# Altium project Smart Thermostat.PrjPcb
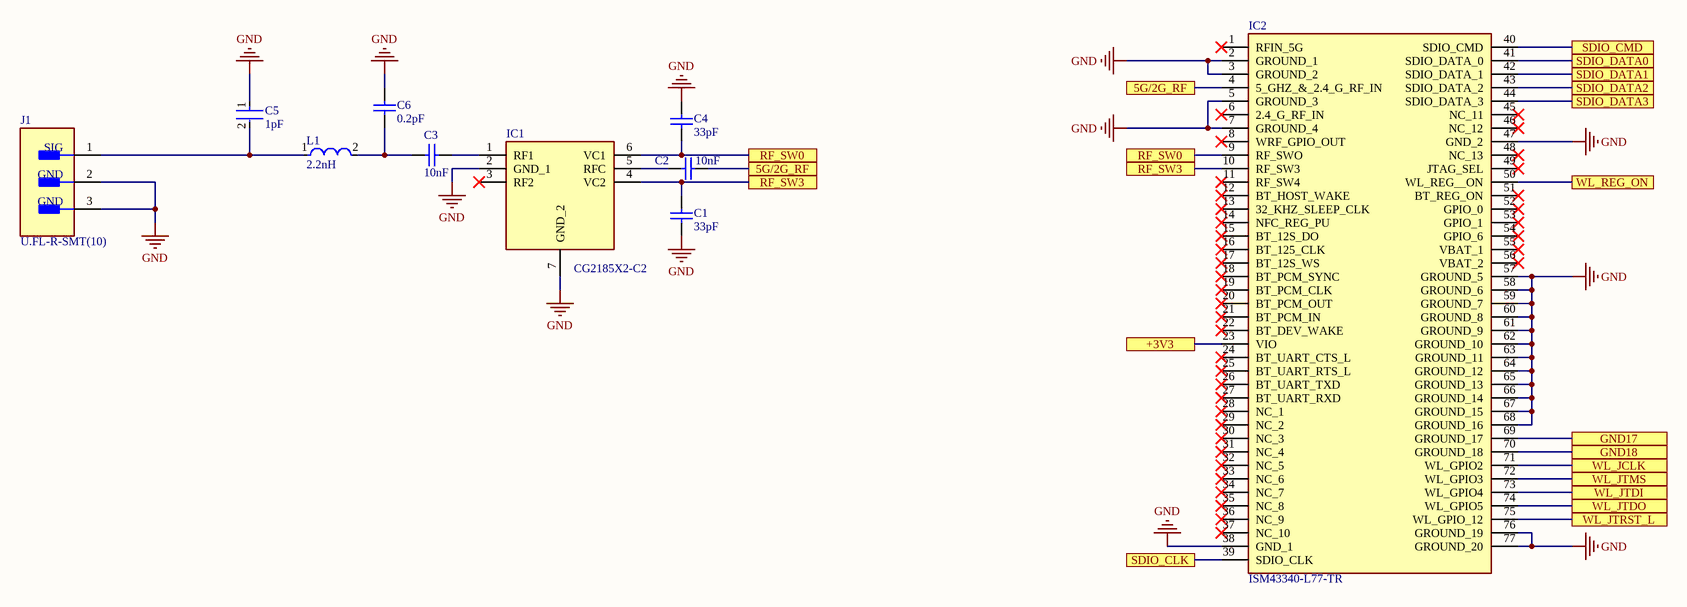
[diagram p0: Wi-Fi.schdoc]
6 sheets, 103 parts. Net scope: flat (ports and power ports of the same name join across sheets).
Board file: PCB1.PcbDoc
Sheets:
  Wi-Fi.schdoc
  LCD.SchDoc
  JTAG.SchDoc
  Relays.SchDoc
  Misc.SchDoc
  CPU.SchDoc

## Sheet Wi-Fi.schdoc
size Tabloid

### Parts
C1  33pF  [CAPC1005X56X25ML10T15]
C2  10nF  [CAPC1608X90X35ML10T15]
C3  10nF  [CAPC1608X90X35ML10T15]
C4  33pF  [CAPC1005X56X25ML10T15]
C5  1pF  [FP-GJM155-0_05-IPC_B]
C6  0.2pF  [CAPC1608X74X38NL10T13]
IC1  CG2185X2-C2  [SON35P100X100X37-7N]
IC2  ISM43340-L77-TR  [ISM43340L77TR]
J1  U.FL-R-SMT(10)  [FP-U_FL-R-SMT_10-MFG]
L1  2.2nH  [FP-LQW15AN_00-W0_6-0_1-MFG]

### Ports
5G/2G_RF, +3V3, GND17, GND18, RF_SW0, RF_SW3, SDIO_CLK, SDIO_CMD, SDIO_DATA0, SDIO_DATA1, SDIO_DATA2, SDIO_DATA3, WL_JCLK, WL_JTDI, WL_JTDO, WL_JTMS, WL_JTRST_L, WL_REG_ON

### Nets
GND: C1.1 C4.2 C5.1 C6.2 IC1.2(GND_1) IC1.7(GND_2) IC2.2(GROUND_1) IC2.3(GROUND_2) IC2.5(GROUND_3) IC2.7(GROUND_4) IC2.38(GND_1) IC2.47(GND_2) IC2.57(GROUND_5) IC2.58(GROUND_6) IC2.59(GROUND_7) IC2.60(GROUND_8) IC2.61(GROUND_9) IC2.62(GROUND_10) IC2.63(GROUND_11) IC2.64(GROUND_12) IC2.65(GROUND_13) IC2.66(GROUND_14) IC2.67(GROUND_15) IC2.68(GROUND_16) IC2.76(GROUND_19) IC2.77(GROUND_20) J1.2(GND) J1.3(GND)
NetC1_2: C1.2 IC1.4(VC2) IC2.10(RF_SW3) ; port RF_SW3
NetC2_1: C2.1 IC1.5(RFC)
NetC2_2: C2.2 IC2.4(5_GHZ_&_2.4_G_RF_IN) ; port 5G/2G_RF
NetC3_1: C3.1 C6.1 L1.2
NetC3_2: C3.2 IC1.1(RF1)
NetC4_1: C4.1 IC1.6(VC1) IC2.9(RF_SWO) ; port RF_SW0
NetC5_2: C5.2 J1.1(SIG) L1.1
NetC11_2: IC2.23(VIO) ; port +3V3
NetIC2_39: IC2.39(SDIO_CLK) ; port SDIO_CLK
NetIC2_40: IC2.40(SDIO_CMD) ; port SDIO_CMD
NetIC2_41: IC2.41(SDIO_DATA_0) ; port SDIO_DATA0
NetIC2_42: IC2.42(SDIO_DATA_1) ; port SDIO_DATA1
NetIC2_43: IC2.43(SDIO_DATA_2) ; port SDIO_DATA2
NetIC2_44: IC2.44(SDIO_DATA_3) ; port SDIO_DATA3
NetIC2_50: IC2.50(WL_REG__ON) ; port WL_REG_ON
NetIC2_69: IC2.69(GROUND_17) ; port GND17
NetIC2_70: IC2.70(GROUND_18) ; port GND18
NetIC2_71: IC2.71(WL_GPIO2) ; port WL_JCLK
NetIC2_72: IC2.72(WL_GPIO3) ; port WL_JTMS
NetIC2_73: IC2.73(WL_GPIO4) ; port WL_JTDI
NetIC2_74: IC2.74(WL_GPIO5) ; port WL_JTDO
NetIC2_75: IC2.75(WL_GPIO_12) ; port WL_JTRST_L

Not connected (* = marked no-connect by the designer): IC1 3(RF2)*; IC2 1(RFIN_5G)* 6(2.4_G_RF_IN)* 8(WRF_GPIO_OUT)* 11(RF_SW4)* 12(BT_HOST_WAKE)* 13(32_KHZ_SLEEP_CLK)* 14(NFC_REG_PU)* 15(BT_12S_DO)* 16(BT_125_CLK)* 17(BT_12S_WS)* 18(BT_PCM_SYNC)* 19(BT_PCM_CLK)* 20(BT_PCM_OUT)* 21(BT_PCM_IN)* 22(BT_DEV_WAKE)* 24(BT_UART_CTS_L)* 25(BT_UART_RTS_L)* 26(BT_UART_TXD)* 27(BT_UART_RXD)* 28(NC_1)* 29(NC_2)* 30(NC_3)* 31(NC_4)* 32(NC_5)* 33(NC_6)* 34(NC_7)* 35(NC_8)* 36(NC_9)* 37(NC_10)* 45(NC_11)* 46(NC_12)* 48(NC_13)* 49(JTAG_SEL)* 51(BT_REG_ON)* 52(GPIO_0)* 53(GPIO_1)* 54(GPIO_6)* 55(VBAT_1)* 56(VBAT_2)*

### Notes on the sheet
- Title
- Size:
- Date:
- Tabloid
- Number:
- Time:
- Revision:
- Sheet
- of
- File:

### Library data of the parts
C1 C4 = CMP-2008-02637-1: Manufacturer: AVX Interconnect / Elco; Part Number: 04025A330JAT2A
C2 C3 = CMP-2100-03642-1: Chip Capacitor, 10 nF, +/- 10%, 50 V, -55 to 125 degC, 0603 (1608 Metric), RoHS, Tape and Reel; Manufacturer: Murata; Insulation Resistance: 10GR; Dielectric: X7R; Voltage Rating: 50V; Material: Ceramic; Package Quantity: 1; Lead Free: LeadFree; Case/Package: 0603; Termination: SMD/SMT; REACH SVHC: Unknown; Manufacturer URL: http://www.murata.com/; Datasheet URL: http://search.murata.co.jp/Ceramy/image/img/A01X/G101/ENG/GRM188R71H103KA01-01.pdf; Mount: SurfaceMount; Datasheet Version: 42401.0; Number of Pins: 2; Length: 1.6mm; Voltage: 50V; Depth: 0.8mm; Tolerance: 10%; Min Operating Temperature: -55degC; Voltage Rating (DC): 50V; Max Operating Temperature: 125degC; Package Description: 2-Pin Surface Mount Device, Body 1.6 x 0.8 mm; RoHSCompliant: True; Case Code (Imperial): 0603; Width: 0.031inch; Case Code (Metric): 1608; Height: 0.8mm; Package Reference: 0603; Packaging: TapeandReel; Thickness: 0.035inch; Capacitance: 10nF; Dielectric Material: Ceramic
C5 = CMP-2008-03808-2: Multi-Layer Ceramic Capacitor 1pF C0G  ±0.1pF 0402 Paper T/R; Temperature Coefficient: 30ppm/°C; Voltage Rating (DC): 50V; REACH SVHC: No SVHC; Packaging: Tape and Reel; Width: 0.02inch; Package Quantity: 10000; Min Operating Temperature: -55°C; Case Code (Imperial): 0402; Lead Pitch: 0.3mm; Capacitance: 1pF; Length: 1mm; Max Operating Temperature: 125°C; Depth: 0.5mm; Thickness: 0.022inch; Case Code (Metric): 1005; Lead Free: Lead Free; Voltage: 50V; Mount: Surface Mount; Number of Pins: 2; Termination: SMD/SMT; Radiation Hardening: No; Dielectric: C0G; Case/Package: 0402; Voltage Rating: 50V; Height: 0.5mm
C6 = CMP-2006-03941-1: Manufacturer: AVX Interconnect / Elco; Part Number: ML03V10R2BAT2A
IC1 = CG2185X2-C2: Integrated Circuit; Manufacturer_Name: CEL; Datasheet Link: https://www.mouser.com/datasheet/2/286/CG2185X2-965115.pdf; Height: 0.37mm; Manufacturer_Part_Number: CG2185X2-C2
IC2 = ISM43340-L77-TR: Integrated Circuit; Manufacturer_Name: Inventek; Datasheet Link: https://www.mouser.com/datasheet/2/908/ISM4334X_Functional_Specification-1371237.pdf; Height: 2mm; Manufacturer_Part_Number: ISM43340-L77-TR; Mouser Part Number: 347-ISM43340L77TR; Mouser Price/Stock: https://www.mouser.com/Search/Refine.aspx?Keyword=347-ISM43340L77TR
J1 = CMP-0029-00003-2: CONN U.FL RCPT STR 50 OHM SMD; Plating: Silver; Connector Type: Coaxial; Frequency: 6GHz; Impedance: 50R; Body Material: Bronze; Dielectric Material: Polymer; Contact Plating: Gold; Termination: Solder; Orientation: Vertical; Contact Material: Brass; Min Operating Temperature: -40°C; Mount: Surface Mount; Lead Free: Lead Free; Max Operating Temperature: 90°C; Radiation Hardening: No; Packaging: Tape and Reel; Body Plating: Silver; Fastening Type: Snap; Max Frequency: 6GHz; Depth: 3.1mm; Package Quantity: 1; Case/Package: SMD/SMT; Housing Color: Beige; Length: 3mm
L1 = CMP-06042-008786-1: Wire Wound RF Inductor 2.2nH ±0.2nH 1000mA 0.027Ω 0402 (1005); Q Factor: 25; Current Rating: 1A; Core Material: Air; Test Frequency: 100MHz; Shielding: Unshielded; DC Resistance (DCR): 27mR; Self Resonant Frequency: 14GHz; Min Operating Temperature: -55°C; Package Quantity: 10000; Length: 1mm; Number of Pins: 2; Radiation Hardening: No; Case Code (Metric): 1005; Termination: SMD/SMT; Inductance: 2.2nH; Mount: Surface Mount; DC Current: 1A; Military Standard: Not; Max Operating Temperature: 125°C; Max DC Current: 1A; Lead Free: Lead Free; Depth: 0.7mm; Case/Package: 0402; Packaging: Tape and Reel; Height: 0.5mm; Width: 0.5mm; REACH SVHC: No SVHC; Weight: 2.8E-05oz; Case Code (Imperial): 0402

## Sheet LCD.SchDoc
size Tabloid
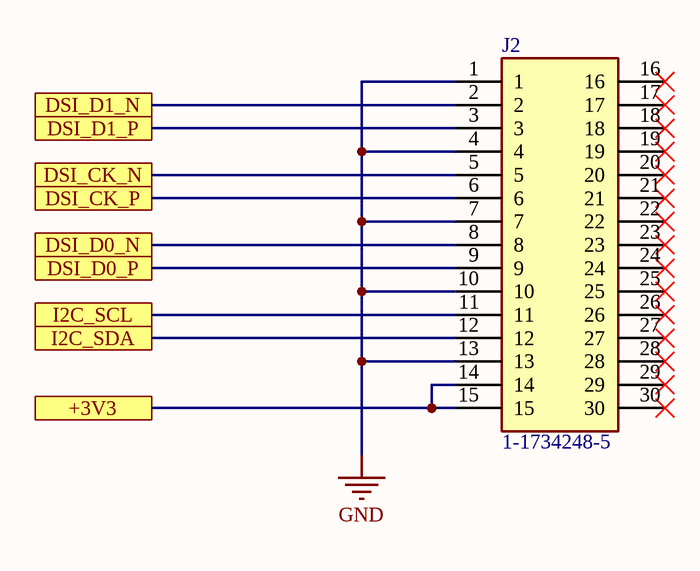
[diagram p1: LCD.SchDoc]

### Parts
J2  1-1734248-5  [117342485]

### Ports
+3V3, DSI_CK_N, DSI_CK_P, DSI_D0_N, DSI_D0_P, DSI_D1_N, DSI_D1_P, I2C_SCL, I2C_SDA

### Nets
GND: J2.1 J2.4 J2.7 J2.10 J2.13
NetC11_2: J2.14 J2.15 ; port +3V3
NetJ2_2: J2.2 ; port DSI_D1_N
NetJ2_3: J2.3 ; port DSI_D1_P
NetJ2_5: J2.5 ; port DSI_CK_N
NetJ2_6: J2.6 ; port DSI_CK_P
NetJ2_8: J2.8 ; port DSI_D0_N
NetJ2_9: J2.9 ; port DSI_D0_P
NetJ2_11: J2.11 ; port I2C_SCL
NetJ2_12: J2.12 ; port I2C_SDA

Not connected (* = marked no-connect by the designer): J2 16* 17* 18* 19* 20* 21* 22* 23* 24* 25* 26* 27* 28* 29* 30*

### Notes on the sheet
- Title
- Size:
- Date:
- Tabloid
- Number:
- Time:
- Revision:
- Sheet
- of
- File:

### Library data of the parts
J2 = 1-1734248-5: Connector; Manufacturer_Name: TE Connectivity; Datasheet Link: https://www.te.com/commerce/DocumentDelivery/DDEController?Action=showdoc&DocId=Customer+Drawing%7F1734248%7FE1%7Fpdf%7FEnglish%7FENG_CD_1734248_E1__.pdf%7F1-1734248-5; Height: 7.7mm; Manufacturer_Part_Number: 1-1734248-5; Mouser Part Number: 571-1-1734248-5; Mouser Price/Stock: https://www.mouser.co.uk/ProductDetail/TE-Connectivity/1-1734248-5/?qs=GQ3BsEl46pkrMd7Fg9TUQQ%3D%3D; Arrow Part Number: 1-1734248-5; Arrow Price/Stock: https://www.arrow.com/en/products/1-1734248-5/te-connectivity

## Sheet JTAG.SchDoc
size Tabloid
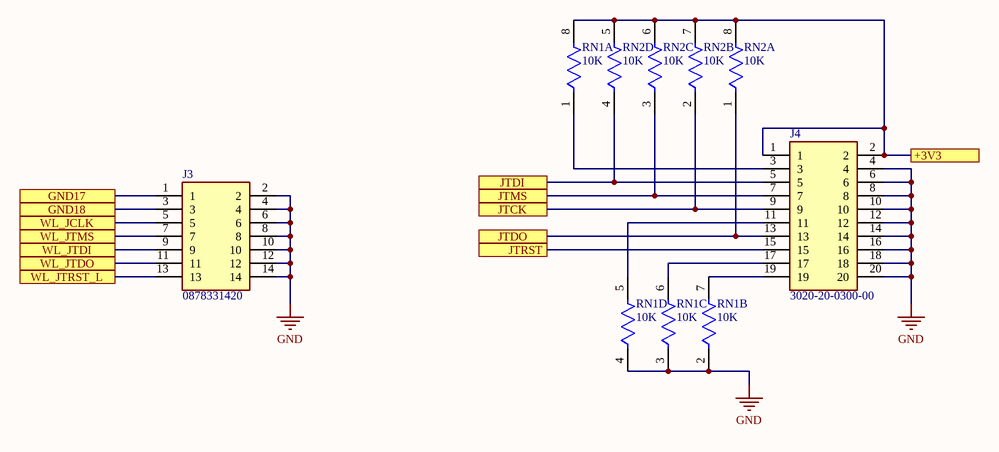
[diagram p2: JTAG.SchDoc]

### Parts
J3  0878331420  [SHDRRA14W55P200_2X7_1665X640X630P]
J4  3020-20-0300-00  [302020030000]
RN1  10K  [FP-CAT16-F4-MFG]  (parts A,B,C,D of 4)
RN2  10K  [FP-CAT16-F4-MFG]  (parts A,B,C,D of 4)

### Ports
+3V3, GND17, GND18, JTCK, JTDI, JTDO, JTMS, JTRST, WL_JCLK, WL_JTDI, WL_JTDO, WL_JTMS, WL_JTRST_L

### Nets
GND: J3.2 J3.4 J3.6 J3.8 J3.10 J3.12 J3.14 J4.4 J4.6 J4.8 J4.10 J4.12 J4.14 J4.16 J4.18 J4.20 RN1.2 RN1.3 RN1.4
NetC11_2: J4.1 J4.2 RN1.8 RN2.5 RN2.6 RN2.7 RN2.8 ; port +3V3
NetIC2_69: J3.1 ; port GND17
NetIC2_70: J3.3 ; port GND18
NetIC2_71: J3.5 ; port WL_JCLK
NetIC2_72: J3.7 ; port WL_JTMS
NetIC2_73: J3.9 ; port WL_JTDI
NetIC2_74: J3.11 ; port WL_JTDO
NetIC2_75: J3.13 ; port WL_JTRST_L
NetJ4_3: J4.3 RN1.1
NetJ4_5: J4.5 RN2.4 ; port JTDI
NetJ4_7: J4.7 RN2.3 ; port JTMS
NetJ4_9: J4.9 RN2.2 ; port JTCK
NetJ4_11: J4.11 RN1.5
NetJ4_13: J4.13 RN2.1 ; port JTDO
NetJ4_15: J4.15 ; port JTRST
NetJ4_17: J4.17 RN1.6
NetJ4_19: J4.19 RN1.7

### Notes on the sheet
- Title
- Size:
- Date:
- Tabloid
- Number:
- Time:
- Revision:
- Sheet
- of
- File:

### Library data of the parts
J3 = 0878331420: Connector; Manufacturer_Name: Molex; Datasheet Link: https://www.molex.com/pdm_docs/sd/878331420_sd.pdf; Height: 6.3mm; Manufacturer_Part_Number: 0878331420; Mouser Part Number: N/A; Mouser Price/Stock: https://www.mouser.co.uk/ProductDetail/Molex/0878331420?qs=PBcRNPEHKsow9zM36KXngg%3D%3D; Arrow Part Number: 0878331420; Arrow Price/Stock: https://www.arrow.com/en/products/0878331420/molex
J4 = 3020-20-0300-00: Connector; Manufacturer_Name: CNC Tech; Datasheet Link: http://cnctech.us/pdfs/3020-XX-0300-00.pdf; Height: 9mm; Manufacturer_Part_Number: 3020-20-0300-00; Arrow Part Number: 3020-20-0300-00; Arrow Price/Stock: https://www.arrow.com/en/products/3020-20-0300-00/cnc-tech-llc
RN1 RN2 = CMP-07230-000003-1: RES ARRAY 4 RES 10K OHM 1206; Manufacturer Part Number: CAT16-1002F4LF; Manufacturer: Bourns; Resistance: 10kΩ; Voltage Rating: 50V; Power Rating: 0.25W; Tolerance: 1%; Number Of Resistors: 4; Value: 10kΩ; Temperature Coefficient: 200ppm/°C; Description: Res Thick Film Array 10K Ohm 1% ISOL Molded 8-Pin 1206 Concave SMD Paper T/R; Power Per Resistor: 0.0625W; Category: Res; Termination: Concave; Series: CAT16; Height: 0.6mm; Device Class L2: Resistors; Digikey Description: RES ARRAY 4 RES 10K OHM 1206; ComponentLink2Description: Datasheet; Temperature Range High: +125°C; ComponentLink2URL: https://www.bourns.com/docs/Product-Datasheets/CATCAY.pdf; Temperature: -55°C to +125°C; Temperature Range Low: -55°C; Octopart: https://octopart.com/cat16-1002f4lf-bourns-1624551; Mouser Description: Resistor Networks & Arrays 10K 1% Concave 4resistors; RoHS: TRUE; Device Class L1: Passive Components; Lead Free: Yes; Automotive: No; Package: CAT16-F4; Device Class L3: Resistor Arrays

## Sheet Relays.SchDoc
size Tabloid
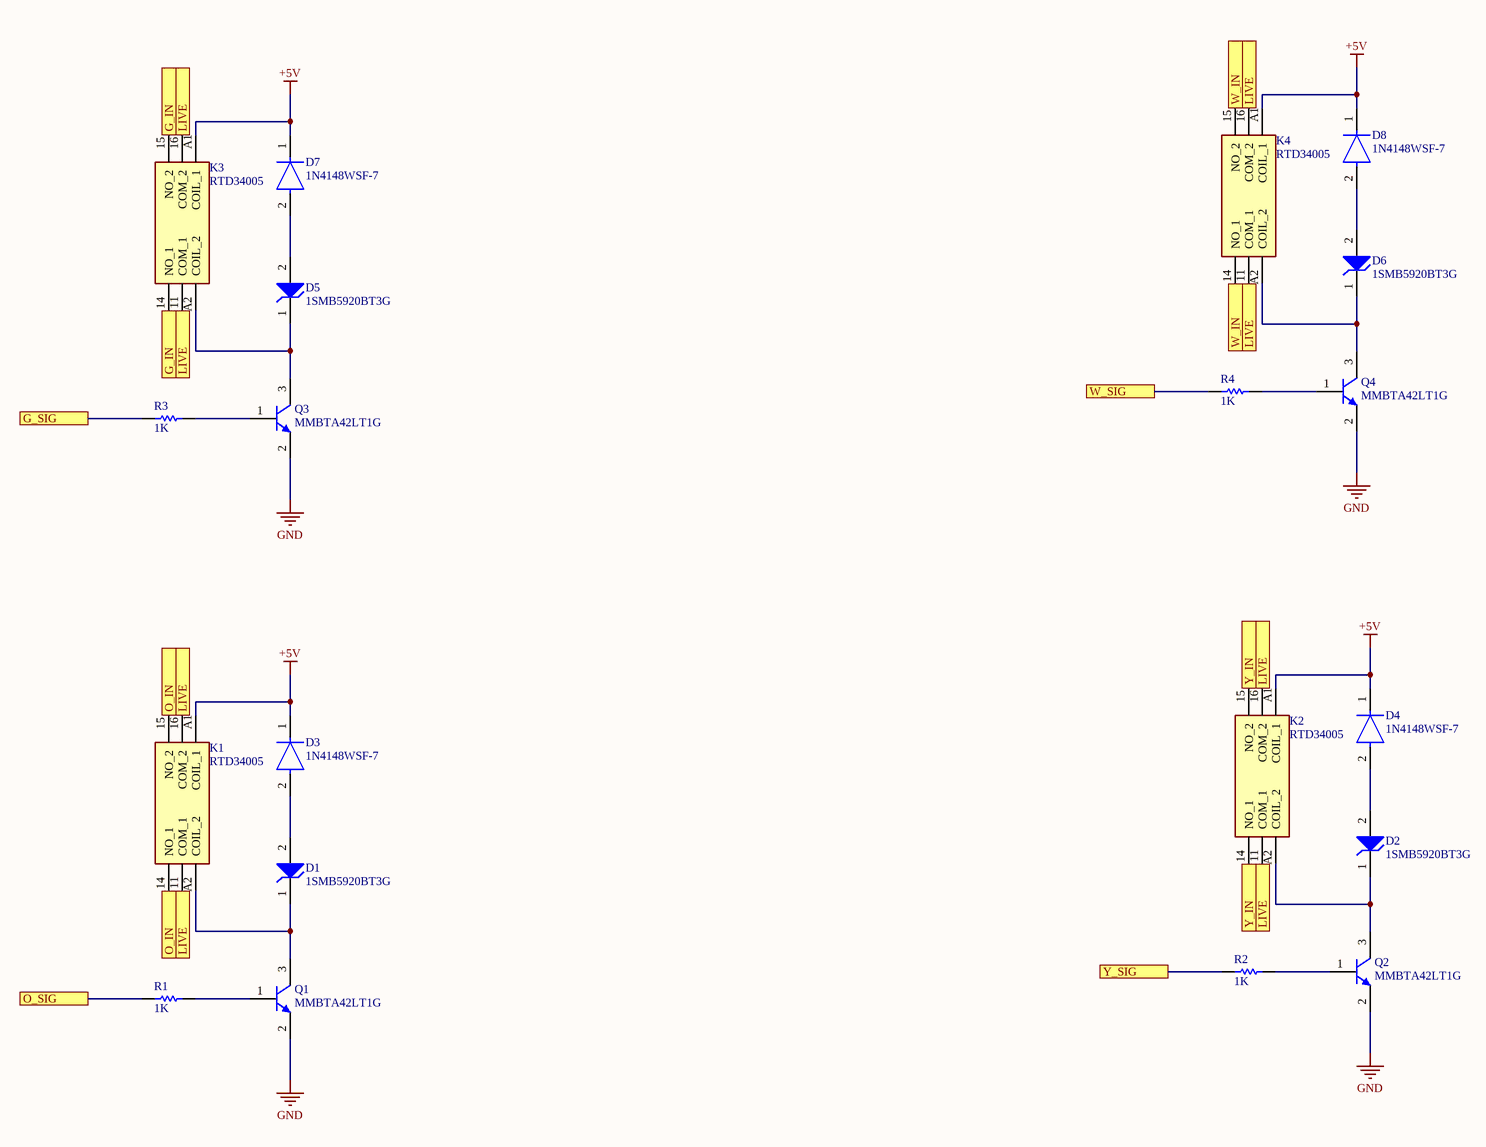
[diagram p3: Relays.SchDoc]

### Parts
D1  1SMB5920BT3G  [ONSC-SMB-2-403A-03_H_V]
D2  1SMB5920BT3G  [ONSC-SMB-2-403A-03_H_V]
D3  1N4148WSF-7  [FP-SOD323F-MFG]
D4  1N4148WSF-7  [FP-SOD323F-MFG]
D5  1SMB5920BT3G  [ONSC-SMB-2-403A-03_H_V]
D6  1SMB5920BT3G  [ONSC-SMB-2-403A-03_H_V]
D7  1N4148WSF-7  [FP-SOD323F-MFG]
D8  1N4148WSF-7  [FP-SOD323F-MFG]
K1  RTD34005  [RTD34005]
K2  RTD34005  [RTD34005]
K3  RTD34005  [RTD34005]
K4  RTD34005  [RTD34005]
Q1  MMBTA42LT1G  [ONSC-SOT-23-3-318-08_V]
Q2  MMBTA42LT1G  [ONSC-SOT-23-3-318-08_V]
Q3  MMBTA42LT1G  [ONSC-SOT-23-3-318-08_V]
Q4  MMBTA42LT1G  [ONSC-SOT-23-3-318-08_V]
R1  1K  [RESC1608X55X30LL20T20]
R2  1K  [RESC1608X55X30LL20T20]
R3  1K  [RESC1608X55X30LL20T20]
R4  1K  [RESC1608X55X30LL20T20]

### Ports
G_IN, G_SIG, LIVE, O_IN, O_SIG, W_IN, W_SIG, Y_IN, Y_SIG

### Nets
+5V: D3.1(C) D4.1(C) D7.1(C) D8.1(C) K1.A1(COIL_1) K2.A1(COIL_1) K3.A1(COIL_1) K4.A1(COIL_1)
GND: Q1.2(E) Q2.2(E) Q3.2(E) Q4.2(E)
NetD1_1: D1.1(K) K1.A2(COIL_2) Q1.3(C)
NetD1_2: D1.2(A) D3.2(A)
NetD2_1: D2.1(K) K2.A2(COIL_2) Q2.3(C)
NetD2_2: D2.2(A) D4.2(A)
NetD5_1: D5.1(K) K3.A2(COIL_2) Q3.3(C)
NetD5_2: D5.2(A) D7.2(A)
NetD6_1: D6.1(K) K4.A2(COIL_2) Q4.3(C)
NetD6_2: D6.2(A) D8.2(A)
NetJ5_1: K4.14(NO_1) K4.15(NO_2) ; port W_IN
NetJ5_2: K2.14(NO_1) K2.15(NO_2) ; port Y_IN
NetJ6_1: K1.14(NO_1) K1.15(NO_2) ; port O_IN
NetJ6_2: K3.14(NO_1) K3.15(NO_2) ; port G_IN
NetK1_11: K1.11(COM_1) K1.16(COM_2) K2.11(COM_1) K2.16(COM_2) K3.11(COM_1) K3.16(COM_2) K4.11(COM_1) K4.16(COM_2) ; port LIVE
NetQ1_1: Q1.1(B) R1.2
NetQ2_1: Q2.1(B) R2.2
NetQ3_1: Q3.1(B) R3.2
NetQ4_1: Q4.1(B) R4.2
NetR1_1: R1.1 ; port O_SIG
NetR2_1: R2.1 ; port Y_SIG
NetR3_1: R3.1 ; port G_SIG
NetR4_1: R4.1 ; port W_SIG

### Notes on the sheet
- Title
- Size:
- Date:
- Tabloid
- Number:
- Time:
- Revision:
- Sheet
- of
- File:

### Library data of the parts
D1 D2 D5 D6 = CMP-1060-00222-1: 3 W Zener Voltage Regulator, 2-Pin SMB, Pb-Free, Tape and Reel; Manufacturer: On Semiconductor; VZ Typ (V): 6.2; Packing: Tape and Reel; PackageDescription: 2-Pin Small Molded Package, J-Bend Lead, Body 4.33 x 3.625 mm; Mounting Technology: Surface Mount; PackageVersion: Rev. H, 05/2011; ComponentLink1Description: Manufacturer URL; RoHS: Pb-Free; DatasheetVersion: Rev. 8; ComponentLink2Description: Datasheet; PartNumber: 1SMB5920BT3G; ComponentLink2URL: http://www.onsemi.com/pub_link/Collateral/1SMB5913BT3-D.PDF; ComponentLink1URL: http://www.onsemi.com/; ComponentLink3Description: Package Specification; PackageReference: SMB-2-403A-03_H; ComponentLink3URL: http://www.onsemi.com/pub_link/Collateral/1SMB5913BT3-D.PDF
D3 D4 D7 D8 = CMP-12791-000029-1: DIODE GEN PURP 100V 250MA SOD323; Manufacturer: Diodes Inc.; Value: 1.5pF; Max Surge Forward Current: 0.5A; Peak Reverse Current: 0.5uA; Max Junction Temp: +150°C; Description: Diode Standard 100V 250mA Surface Mount SOD-323F; Height: 0.75mm; Digikey Description: DIODE GEN PURP 100V 250MA SOD323; Automotive: No; Footprint Url: https://www.diodes.com/assets/Package-Files/SOD323F.pdf; Category: Diode; Manufacturer Part Number: 1N4148WSF-7; Max Repetitive Reverse Voltage: 100V; Lead Free: Yes; Temperature Range High: +150°C; Forward Current: 250mA; Reverse Voltage: 100V; Device Class L3: Rectifier Diodes; ComponentLink2URL: https://www.diodes.com/assets/Datasheets/1N4148WSF.pdf; Package: SOD323F; RoHS: TRUE; Mouser Description: Diodes - General Purpose, Power, Switching 200mW 2pF 75Vrrm 150mA 2A 1VF; Temperature: -55°C to +150°C; Capacitance: 1.5pF; Device Class L2: Diodes; ComponentLink2Description: Datasheet; Device Class L1: Discrete Semiconductors; Octopart: https://octopart.com/1n4148wsf-7-diodes+inc.-33798544; Temperature Range Low: -55°C
K1-K4 = RTD34005: Relay or Contactor; Manufacturer_Name: TE Connectivity; Datasheet Link: https://www.te.com/commerce/DocumentDelivery/DDEController?Action=showdoc&DocId=Data+Sheet%7FRT1%7F0219%7Fpdf%7FEnglish%7FENG_DS_RT1_0219.pdf%7F9-1393239-8; Height: 15.7mm; Manufacturer_Part_Number: RTD34005; Mouser Part Number: 655-RTD34005; Mouser Price/Stock: https://www.mouser.co.uk/ProductDetail/TE-Connectivity-Schrack/RTD34005?qs=BIWSwG%252BH%252B8jXtcbsbuQ74A%3D%3D; Arrow Part Number: RTD34005; Arrow Price/Stock: https://www.arrow.com/en/products/rtd34005/te-connectivity
Q1-Q4 = CMP-1048-00662-1: High Voltage Transistor, NPN Silicon, 3-Pin SOT-23, Pb-Free, Tape and Reel; Manufacturer: On Semiconductor; fT Min (MHz): 50; IC Continuous (A): 0.5; ComponentLink1URL: http://www.onsemi.com/; ComponentLink3URL: http://www.onsemi.cn/pub_link/Collateral/318-08.PDF; RoHS: TRUE; ComponentLink2Description: Datasheet; PartNumber: MMBTA42LT1G; Polarity: NPN; DatasheetVersion: Rev. 12; PackageReference: SOT-23-3-318-08; PackageDescription: 3-Pin Small Outline Transistor, Body 2.92 x 1.3 mm, Pitch 0.95 mm; ComponentLink3Description: Package Specification; ComponentLink1Description: Manufacturer URL; Packing: Tape and Reel; PackageVersion: Rev. AP, 11/2009; Mounting Technology: Surface Mount; ComponentLink2URL: http://www.onsemi.cn/pub_link/Collateral/MMBTA42LT1-D.PDF
R1-R4 = CMP-2000-00873-1: Manufacturer: Panasonic; Part Number: ERA3AEB102V

## Sheet Misc.SchDoc
size Tabloid
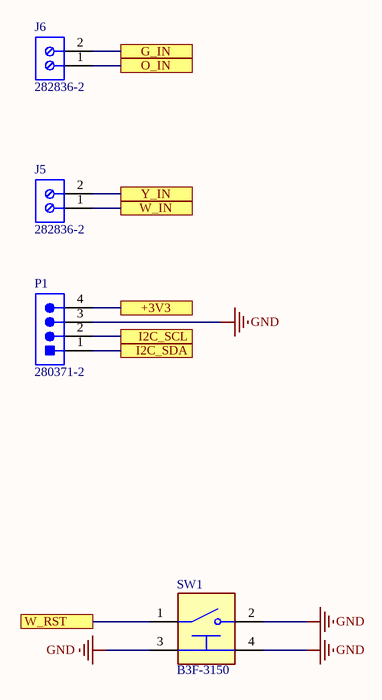
[diagram p4: Misc.SchDoc]

### Parts
J5  282836-2  [TECO-282836-2_V]
J6  282836-2  [TECO-282836-2_V]
P1  280371-2  [TECO-280371-2_V]
SW1  B3F-3150  [FP-B3F-3150-MFG]

### Ports
+3V3, G_IN, I2C_SCL, I2C_SDA, O_IN, W_IN, W_RST, Y_IN

### Nets
GND: P1.3 SW1.2 SW1.3(MNT_1) SW1.4(MNT_2)
NetC11_2: P1.4 ; port +3V3
NetJ2_11: P1.2 ; port I2C_SCL
NetJ2_12: P1.1 ; port I2C_SDA
NetJ5_1: J5.1 ; port W_IN
NetJ5_2: J5.2 ; port Y_IN
NetJ6_1: J6.1 ; port O_IN
NetJ6_2: J6.2 ; port G_IN
NetSW1_1: SW1.1 ; port W_RST

### Notes on the sheet
- Title
- Size:
- Date:
- Tabloid
- Number:
- Time:
- Revision:
- Sheet
- of
- File:

### Library data of the parts
J5 J6 = CMP-1684-00017-1: Female Header, Pitch 5 mm, 1 x 2 Position, Height 10 mm, Tail Length 3.5 mm, Rohs, Bulk; Manufacturer: TE Connectivity; Wire Gauge: 16-30AWG; Product Training Modules: Wire-to-BoardEurostyleTerminalBlocks; Clamp Material - Plating: Brass-NickelPlated; Voltage: 300V; Mating Orientation: HorizontalwithBoard; Current: 13.5A; Pitch: 0.197"(5.00mm); Screw Thread: M3; 3D Model: 282836-2.pdf; Other Names: 5ULV-02B / A98076; Dynamic Catalog: BuchananSeries; Number of Levels: 1; Torque - Screw: 0.68Nm(6Lb-In); Featured Product: EurostyleTerminalBlockConnectors; Positions Per Level: 2; Wire Termination: Screw-RisingCageClamp; Datasheet URL: http://www.te.com.cn/commerce/DocumentDelivery/DDEController?Action=showdoc&DocId=Catalog+Section%7F1308389_EUROSTYLE_TERMINAL_BLOCKS%7F0607%7Fpdf%7FEnglish%7FENG_CS_1308389_EUROSTYLE_TERMINAL_BLOCKS_0607.pdf%7F282836-2; Color: Green; Family: TerminalBlocks-WiretoBoard; RoHS Information: 282836-2StatementofCompliance; Standard Package: 300; Contact Material - Plating: Brass-TinPlated; Manufacturer URL: http://www.te.com; Housing Material: Polyamide(PA66),Nylon6/6; Features: Interlocking(Side); Package Description: Female Header, Pitch 5 mm, 1 x 2 Position, Height 10 mm, Tail Length 3.5 mm; Mounting Type: ThroughHole; Package Reference: THD; Packaging: Bulk; Series: Buchanan; Category: Connectors,Interconnects; Screw Material - Plating: Brass-NickelPlated
P1 = CMP-2000-05548-1: Male Header, Pitch 2.54 mm, 1 x 4 Position, Height 12.8 mm, Tail Length 3.5 mm, -55 to 105 degC, RoHS, Bulk; Manufacturer: TE Connectivity; Pitch: 0.100"(2.54mm); Connector Type: Header,Shrouded; Other Names: 280371-2-ND / A106401; Number of Positions Loaded: All; Dynamic Catalog: AMPMODUModIISeries; Number of Positions: 4; 3D Model: 280371-2.pdf; Termination: Solder; Package Description: Male Header, Pitch 2.54 mm, 1 x 4 Position, Height 12.8 mm, Tail Length 3.5 mm; Datasheet Version: Rev. M1, 08/2016; Contact Mating Length: 0.260"(6.60mm); Datasheet URL: http://www.te.com/commerce/DocumentDelivery/DDEController?Action=showdoc&DocId=Customer+Drawing%7F280370%7FM1%7Fpdf%7FEnglish%7FENG_CD_280370_M1.pdf%7F280371-2; Mounting Technology: ThroughHole; Standard Package: 1,000; Contact Finish Thickness: 15µin(0.38µm); Contact Finish: Gold; Contact Type: MalePin; Packaging: Bulk; Mounting Type: ThroughHole; Number of Rows: 1; Family: RectangularConnectors-Headers,MalePins; Manufacturer URL: http://www.te.com/; Color: Black; RoHS Information: 280371-2StatementofCompliance; Package Reference: 280371-2; Category: Connectors,Interconnects; Series: AMPMODUModII
SW1 = CMP-08834-000006-1: SWITCH TACTILE SPST-NO 0.05A 24V; Manufacturer: Omron; Contact Current Rating: 50mA; Electromechanical Life: 1000000Cycles; Description: Tactile Switch SPST-NO Side Actuated Through Hole, Right Angle; Contact Resistance: 100mΩ; Operating Force: 0.98N; Octopart: https://octopart.com/b3f-3150-omron-49234; Device Class L1: Electromechanical; Device Class L2: Switches; Temperature Range Low: -25°C; Temperature Range High: +70°C; Mouser Description: Tactile Switches R/A 6X6 6.15mm BTN; Temperature: -25°C to +70°C; Voltage Rating Dc: 24V; Automotive: No; Ambient Temperature Range Low: -25°C; Ambient Temperature Range High: +70°C; Mount: Through Hole; ComponentLink2URL: https://omronfs.omron.com/en_US/ecb/products/pdf/en-b3f.pdf; RoHS: TRUE; ComponentLink2Description: Datasheet; Digikey Description: SWITCH TACTILE SPST-NO 0.05A 24V; Package: 0; Height: 7.8mm; Throw Configuration: SPST-NO; Lead Free: Yes; Device Class L3: Tactile Switches; Category: Switch; Manufacturer Part Number: B3F-3150

## Sheet CPU.SchDoc
size Tabloid
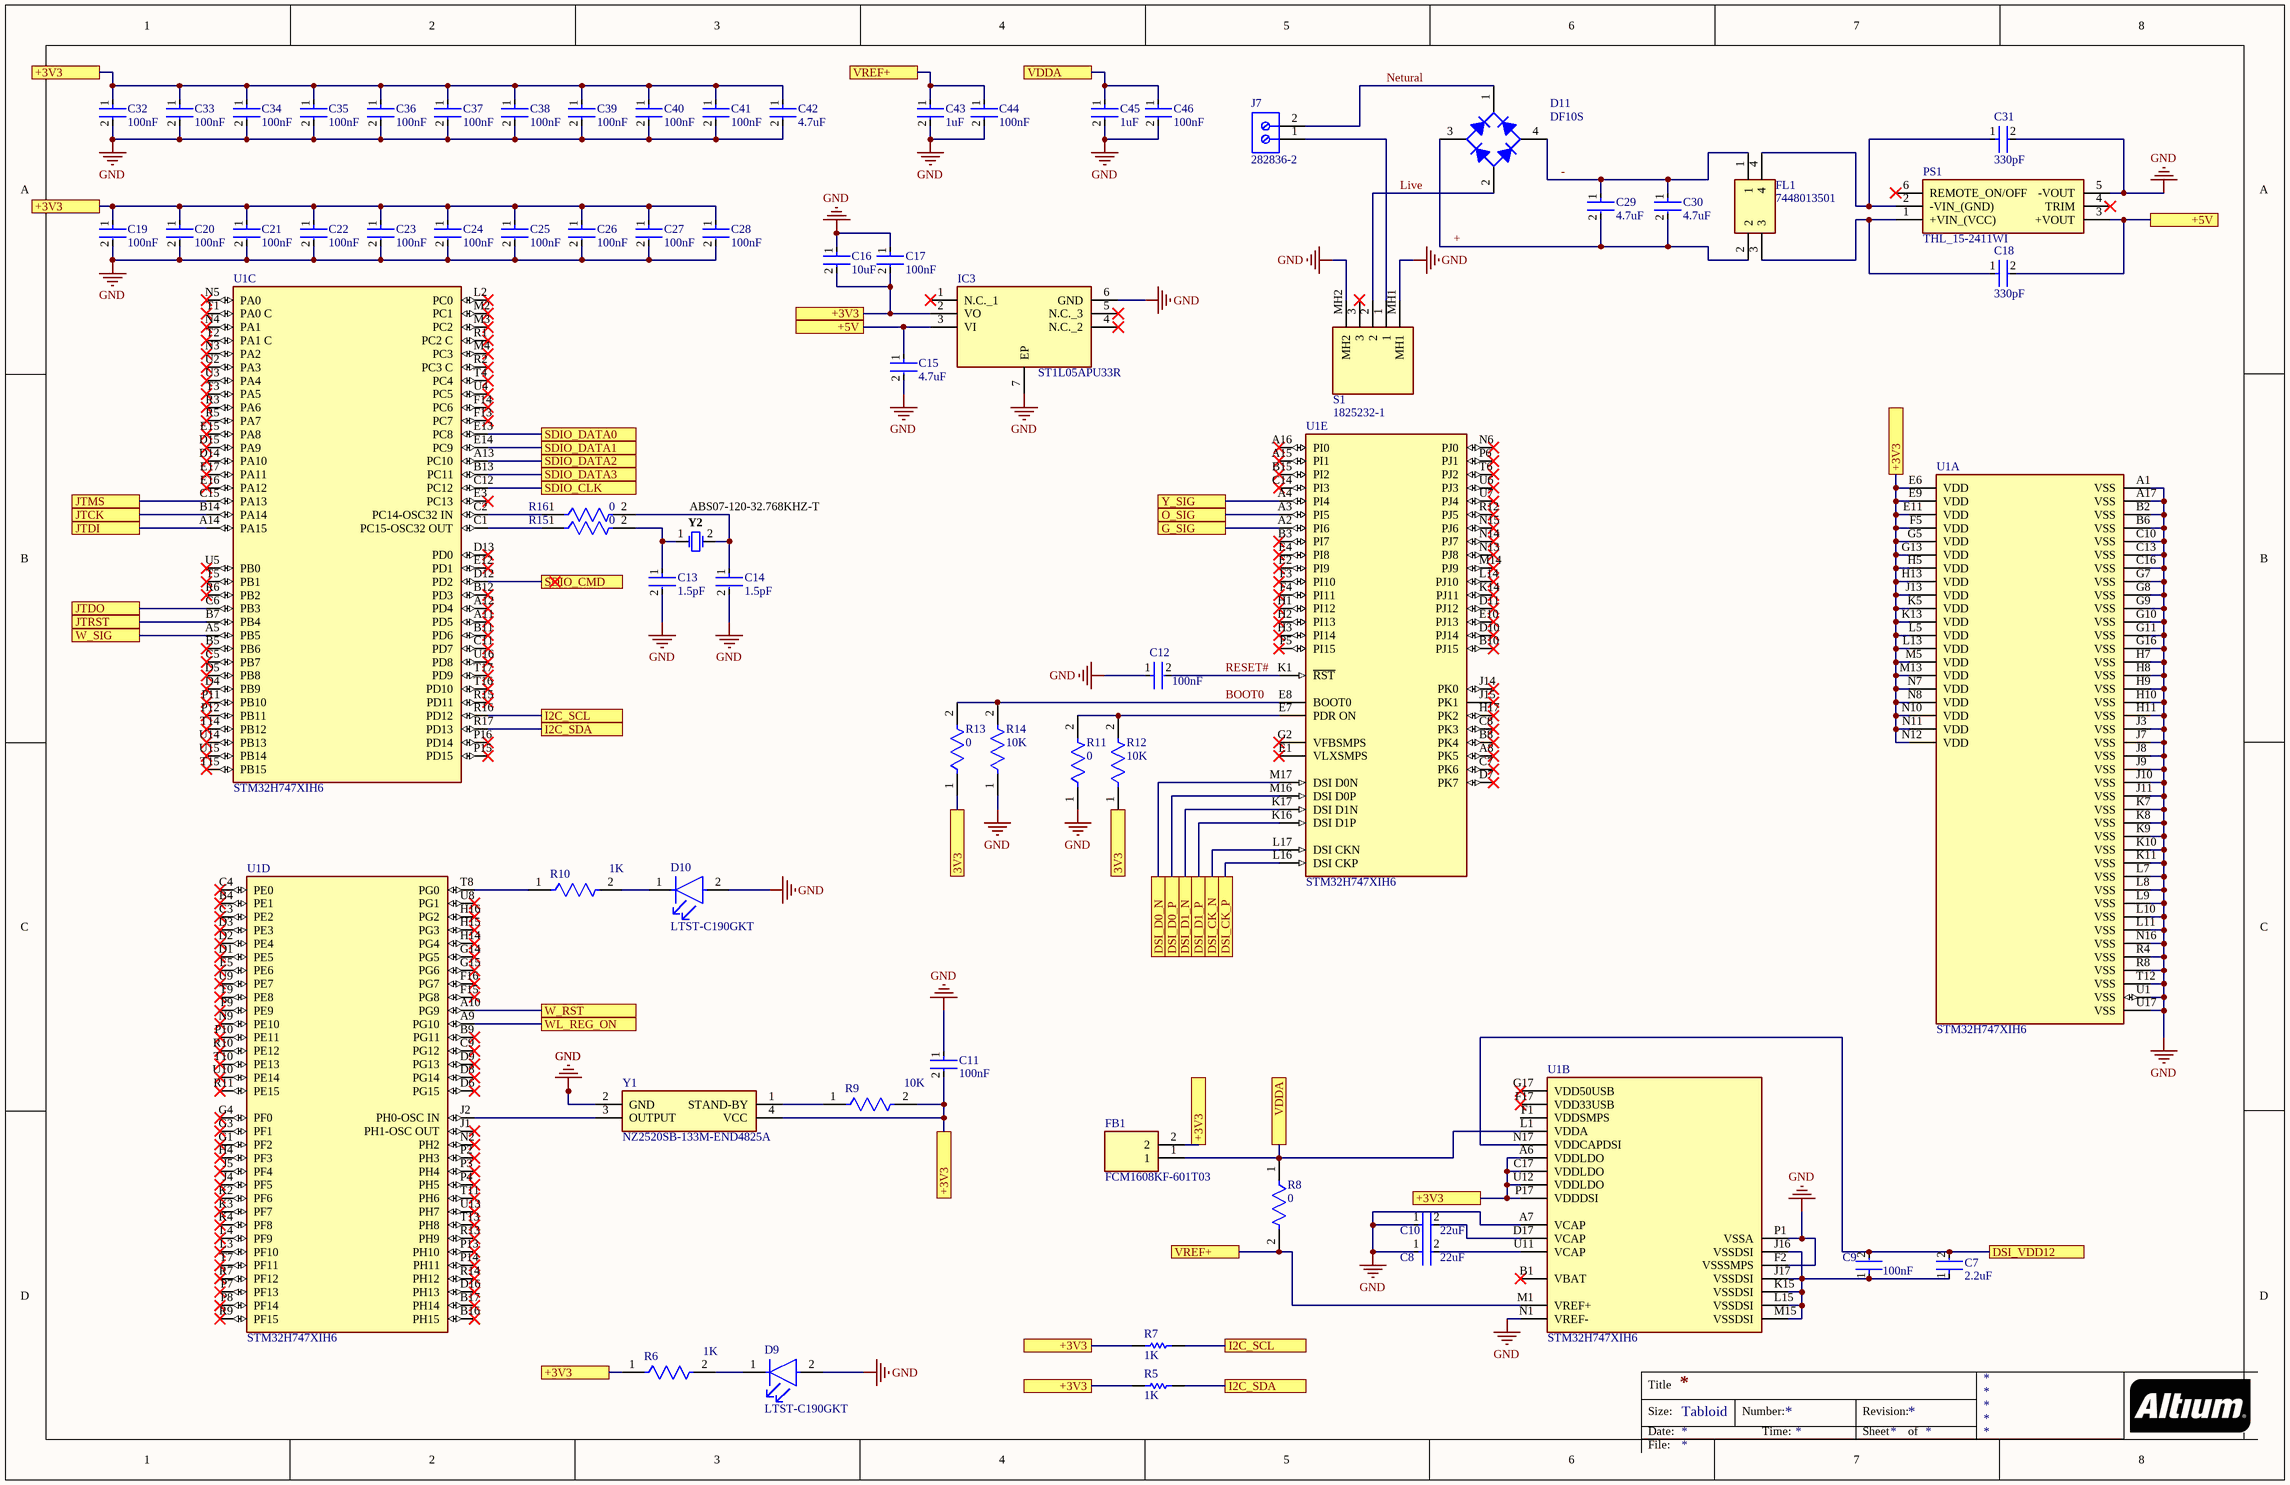
[diagram p5: CPU.SchDoc]

### Parts
C7  2.2uF  [FP-GJM155-0_05-IPC_C]
C8  22uF  [FP-GJM155-0_05-IPC_C]
C9  100nF  [FP-GJM155-0_05-IPC_C]
C10  22uF  [FP-GJM155-0_05-IPC_C]
C11  100nF  [FP-GJM155-0_05-IPC_C]
C12  100nF  [FP-GJM155-0_05-IPC_C]
C13  1.5pF  [FP-GJM155-0_05-IPC_C]
C14  1.5pF  [FP-GJM155-0_05-IPC_C]
C15  4.7uF  [FP-GRM155-0_1-IPC_B]
C16  10uF  [FP-GRM188-0_1-e0_2_0_55-IPC_A]
C17  100nF  [FP-GRM033-0_03-MFG]
C18  330pF  [FP-GRM155-0_05-MFG]
C19  100nF  [FP-GRM033-0_03-MFG]
C20  100nF  [FP-GRM033-0_03-MFG]
C21  100nF  [FP-GRM033-0_03-MFG]
C22  100nF  [FP-GRM033-0_03-MFG]
C23  100nF  [FP-GRM033-0_03-MFG]
C24  100nF  [FP-GRM033-0_03-MFG]
C25  100nF  [FP-GRM033-0_03-MFG]
C26  100nF  [FP-GRM033-0_03-MFG]
C27  100nF  [FP-GRM033-0_03-MFG]
C28  100nF  [FP-GRM033-0_03-MFG]
C29  4.7uF  [FP-GRM155-0_1-IPC_B]
C30  4.7uF  [FP-GRM155-0_1-IPC_B]
C31  330pF  [FP-GRM155-0_05-MFG]
C32  100nF  [FP-GRM033-0_03-MFG]
C33  100nF  [FP-GRM033-0_03-MFG]
C34  100nF  [FP-GRM033-0_03-MFG]
C35  100nF  [FP-GRM033-0_03-MFG]
C36  100nF  [FP-GRM033-0_03-MFG]
C37  100nF  [FP-GRM033-0_03-MFG]
C38  100nF  [FP-GRM033-0_03-MFG]
C39  100nF  [FP-GRM033-0_03-MFG]
C40  100nF  [FP-GRM033-0_03-MFG]
C41  100nF  [FP-GRM033-0_03-MFG]
C42  4.7uF  [FP-GRM155-0_1-IPC_B]
C43  1uF  [FP-GRM15-0_1-MFG]
C44  100nF  [FP-GRM033-0_03-MFG]
C45  1uF  [FP-GRM15-0_1-MFG]
C46  100nF  [FP-GRM033-0_03-MFG]
D9  LTST-C190GKT  [FP-LTST-C190GKT-MFG]
D10  LTST-C190GKT  [FP-LTST-C190GKT-MFG]
D11  DF10S  [FAIR-SDIP-4_V]
FB1  FCM1608KF-601T03  [BEADC1608X95N]
FL1  7448013501  [7448013501]
IC3  ST1L05APU33R  [SON95P300X300X100-7N-D]
J7  282836-2  [TECO-282836-2_V]
PS1  THL_15-2411WI  [THL152411WI]
R5  1K  [RESC1608X55X30LL20T20]
R6  1K  [FP-CRCW0402-e3-MFG]
R7  1K  [RESC1608X55X30LL20T20]
R8  0  [FP-CRCW0402-e3-IPC_C]
R9  10K  [FP-CRCW0402-e3-MFG]
R10  1K  [FP-CRCW0402-e3-MFG]
R11  0  [FP-CRCW0402-e3-IPC_C]
R12  10K  [FP-CRCW0402-e3-IPC_C]
R13  0  [FP-CRCW0402-e3-IPC_C]
R14  10K  [FP-CRCW0402-e3-IPC_C]
R15  0  [FP-CRCW0402-e3-IPC_C]
R16  0  [FP-CRCW0402-e3-IPC_C]
S1  1825232-1  [18252321]
U1  STM32H747XIH6  [FP-TFBGA240+25-A07U-MFG]  (parts A,B,C,D,E of 5)
Y1  NZ2520SB-133M-END4825A  [NZ2520SD]
Y2  ABS07-120-32.768KHZ-T  [ABRA-ABS07_A_V]

### Ports
3V3, +3V3, +5V, DSI_CK_N, DSI_CK_P, DSI_D0_N, DSI_D0_P, DSI_D1_N, DSI_D1_P, DSI_VDD12, G_SIG, I2C_SCL, I2C_SDA, JTCK, JTDI, JTDO, JTMS, JTRST, O_SIG, SDIO_CLK, SDIO_CMD, SDIO_DATA0, SDIO_DATA1, SDIO_DATA2, SDIO_DATA3, VDDA, VREF+, W_RST, W_SIG, WL_REG_ON, Y_SIG

### Nets
GND: C8.1 C10.1 C11.1 C12.1 C13.2 C14.2 C15.2 C16.1 C17.1 C19.2 C20.2 C21.2 C22.2 C23.2 C24.2 C25.2 C26.2 C27.2 C28.2 C31.2 C32.2 C33.2 C34.2 C35.2 C36.2 C37.2 C38.2 C39.2 C40.2 C41.2 C42.2 C43.2 C44.2 C45.2 C46.2 D9.2(A) D10.2(A) IC3.6(GND) IC3.7(EP) PS1.5(-VOUT) R11.1 R14.1 S1.MH1 S1.MH2 U1.A1(VSS) U1.A7(VCAP) U1.A17(VSS) U1.B2(VSS) U1.B6(VSS) U1.C10(VSS) U1.C13(VSS) U1.C16(VSS) U1.F2(VSSSMPS) U1.G7(VSS) U1.G8(VSS) U1.G9(VSS) U1.G10(VSS) U1.G11(VSS) U1.G16(VSS) U1.H7(VSS) U1.H8(VSS) U1.H9(VSS) U1.H10(VSS) U1.H11(VSS) U1.J3(VSS) U1.J7(VSS) U1.J8(VSS) U1.J9(VSS) U1.J10(VSS) U1.J11(VSS) U1.K7(VSS) U1.K8(VSS) U1.K9(VSS) U1.K10(VSS) U1.K11(VSS) U1.L7(VSS) U1.L8(VSS) U1.L9(VSS) U1.L10(VSS) U1.L11(VSS) U1.N1(VREF-) U1.N16(VSS) U1.P1(VSSA) U1.R4(VSS) U1.R8(VSS) U1.T12(VSS) U1.U1(VSS) U1.U17(VSS) Y1.2(GND)
+: C29.2 C30.2 D11.3(C) FL1.2
-: C29.1 C30.1 D11.4(C) FL1.1
BOOT0: R13.2 R14.2 U1.E8(BOOT0)
Live: D11.2(A) S1.2
Netural: D11.1(K) J7.2
RESET#: C12.2 U1.K1(~{RST})
NetC7_1: C7.1 C9.1 U1.J16(VSSDSI) U1.J17(VSSDSI) U1.K15(VSSDSI) U1.L15(VSSDSI) U1.M15(VSSDSI)
NetC7_2: C7.2 C9.2 U1.N17(VDDCAPDSI) ; port DSI_VDD12
NetC8_2: C8.2 U1.U11(VCAP)
NetC10_2: C10.2 U1.D17(VCAP)
NetC11_2: C11.2 C16.2 C17.2 C19.1 C20.1 C21.1 C22.1 C23.1 C24.1 C25.1 C26.1 C27.1 C28.1 C32.1 C33.1 C34.1 C35.1 C36.1 C37.1 C38.1 C39.1 C40.1 C41.1 C42.1 FB1.2 IC3.2(VO) R5.1 R6.1 R7.1 R9.2 U1.A6(VDDLDO) U1.C17(VDDLDO) U1.E6(VDD) U1.E9(VDD) U1.E11(VDD) U1.F5(VDD) U1.G5(VDD) U1.G13(VDD) U1.H5(VDD) U1.H13(VDD) U1.J13(VDD) U1.K5(VDD) U1.K13(VDD) U1.L5(VDD) U1.L13(VDD) U1.M5(VDD) U1.M13(VDD) U1.N7(VDD) U1.N8(VDD) U1.N10(VDD) U1.N11(VDD) U1.N12(VDD) U1.P17(VDDDSI) U1.U12(VDDLDO) Y1.4(VCC) ; port +3V3
NetC13_1: C13.1 R15.2 Y2.1
NetC14_1: C14.1 R16.2 Y2.2
NetC15_1: C15.1 C18.2 IC3.3(VI) PS1.3(+VOUT) ; port +5V
NetC18_1: C18.1 FL1.3 PS1.1(+VIN_(VCC))
NetC31_1: C31.1 FL1.4 PS1.2(-VIN_(GND))
NetC43_1: C43.1 C44.1 R8.2 U1.M1(VREF+) ; port VREF+
NetC45_1: C45.1 C46.1 FB1.1 R8.1 U1.L1(VDDA) ; port VDDA
NetD9_1: D9.1(C) R6.2
NetD10_1: D10.1(C) R10.2
NetIC2_39: U1.C12(PC12) ; port SDIO_CLK
NetIC2_40: U1.D12(PD2) ; port SDIO_CMD
NetIC2_41: U1.E13(PC8) ; port SDIO_DATA0
NetIC2_42: U1.E14(PC9) ; port SDIO_DATA1
NetIC2_43: U1.A13(PC10) ; port SDIO_DATA2
NetIC2_44: U1.B13(PC11) ; port SDIO_DATA3
NetIC2_50: U1.A9(PG10) ; port WL_REG_ON
NetJ2_2: U1.K17(DSI_D1N) ; port DSI_D1_N
NetJ2_3: U1.K16(DSI_D1P) ; port DSI_D1_P
NetJ2_5: U1.L17(DSI_CKN) ; port DSI_CK_N
NetJ2_6: U1.L16(DSI_CKP) ; port DSI_CK_P
NetJ2_8: U1.M17(DSI_D0N) ; port DSI_D0_N
NetJ2_9: U1.M16(DSI_D0P) ; port DSI_D0_P
NetJ2_11: R7.2 U1.R16(PD12) ; port I2C_SCL
NetJ2_12: R5.2 U1.R17(PD13) ; port I2C_SDA
NetJ4_5: U1.A14(PA15) ; port JTDI
NetJ4_7: U1.C15(PA13) ; port JTMS
NetJ4_9: U1.B14(PA14) ; port JTCK
NetJ4_13: U1.C6(PB3) ; port JTDO
NetJ4_15: U1.B7(PB4) ; port JTRST
NetJ7_1: J7.1 S1.1
NetR1_1: U1.A3(PI5) ; port O_SIG
NetR2_1: U1.A4(PI4) ; port Y_SIG
NetR3_1: U1.A2(PI6) ; port G_SIG
NetR4_1: U1.A5(PB5) ; port W_SIG
NetR9_1: R9.1 Y1.1(STAND-BY)
NetR10_1: R10.1 U1.T8(PG0)
NetR11_2: R11.2 R12.2 U1.E7(PDR_ON)
NetR12_1: R12.1 R13.1 ; port 3V3
NetR15_1: R15.1 U1.C1(PC15-OSC32_OUT)
NetR16_1: R16.1 U1.C2(PC14-OSC32_IN)
NetSW1_1: U1.A10(PG9) ; port W_RST
NetU1_J2: U1.J2(PH0-OSC_IN) Y1.3(OUTPUT)

Not connected (* = marked no-connect by the designer): IC3 1(N.C._1)* 4(N.C._2)* 5(N.C._3)*; PS1 4(TRIM)* 6(REMOTE_ON/OFF)*; S1 3*; U1 A8(PK5)* A11(PD5)* A12(PD4)* A15(PI1)* A16(PI0)* B1(VBAT)* B3(PI7)* B4(PE1)* B5(PB6)* B8(PK4)* B9(PG11)* B10(PJ15)* B11(PD6)* B12(PD3)* B15(PI2)* B16(PH15)* B17(PH14)* C3(PE2)* C4(PE0)* C5(PB7)* C7(PK6)* C8(PK3)* C9(PG12)* C11(PD7)* C14(PI3)* D1(PE5)* D2(PE4)* D3(PE3)* D4(PB9)* D5(PB8)* D6(PG15)* D7(PK7)* D8(PG14)* D9(PG13)* D10(PJ14)* D11(PJ12)* D13(PD0)* D14(PA10)* D15(PA9)* D16(PH13)* E1(VLXSMPS)* E2(PI9)* E3(PC13)* E4(PI8)* E5(PE6)* E10(PJ13)* E12(PD1)* E15(PA8)* E16(PA12)* E17(PA11)* F1(VDDSMPS) F3(PI10)* F4(PI11)* F13(PC7)* F14(PC6)* F15(PG8)* F16(PG7)* F17(VDD33USB)* G1(PF2)* G2(VFBSMPS)* G3(PF1)* G4(PF0)* G14(PG5)* G15(PG6)* G17(VDD50USB)* H1(PI12)* H2(PI13)* H3(PI14)* H4(PF3)* H14(PG4)* H15(PG3)* H16(PG2)* H17(PK2)* J1(PH1-OSC_OUT)* J4(PF5)* J5(PF4)* J14(PK0)* J15(PK1)* K2(PF6)* K3(PF7)* K4(PF8)* K14(PJ11)* L2(PC0)* L3(PF10)* L4(PF9)* L14(PJ10)* M2(PC1)* M3(PC2)* M4(PC3)* M14(PJ9)* N2(PH2)* N3(PA2)* N4(PA1)* N5(PA0)* N6(PJ0)* N9(PE10)* N13(PJ8)* N14(PJ7)* N15(PJ6)* P2(PH3)* P3(PH4)* P4(PH5)* P5(PI15)* P6(PJ1)* P7(PF13)* P8(PF14)* P9(PE9)* P10(PE11)* P11(PB10)* P12(PB11)* P13(PH10)* P14(PH11)* P15(PD15)* P16(PD14)* R1(PC2_C)* R2(PC3_C)* R3(PA6)* R5(PA7)* R6(PB2)* R7(PF12)* R9(PF15)* R10(PE12)* R11(PE15)* R12(PJ5)* R13(PH9)* R14(PH12)* R15(PD11)* T1(PA0_C)* T2(PA1_C)* T3(PA5)* T4(PC4)* T5(PB1)* T6(PJ2)* T7(PF11)* T9(PE8)* T10(PE13)* T11(PH6)* T13(PH8)* T14(PB12)* T15(PB15)* T16(PD10)* T17(PD9)* U2(PA3)* U3(PA4)* U4(PC5)* U5(PB0)* U6(PJ3)* U7(PJ4)* U8(PG1)* U9(PE7)* U10(PE14)* U13(PH7)* U14(PB13)* U15(PB14)* U16(PD8)*

### Notes on the sheet
- Title
- Size:
- Date:
- Tabloid
- Number:
- Time:
- Revision:
- Sheet
- of
- File:

### Library data of the parts
C7-C14 = CMP-2008-03820-2: Multi-Layer Ceramic Capacitor 1.5pF C0G  ±0.1pF 0402 Paper T/R; Temperature Coefficient: 30ppm/°C; Voltage Rating: 50V; Depth: 0.5mm; Case Code (Imperial): 0402; Package Quantity: 10000; Length: 1mm; Number of Pins: 2; Max Operating Temperature: 125°C; Mount: Surface Mount; Construction: Flat; Thickness: 0.022inch; Series: GJM; Packaging: Tape and Reel; Radiation Hardening: No; REACH SVHC: No SVHC; Case/Package: 0402; Lead Free: Lead Free; Voltage Rating (DC): 50V; Min Operating Temperature: -55°C; Dielectric: C0G; Termination: SMD/SMT; Width: 0.5mm; Capacitance: 1.5pF; Lead Pitch: 0.3mm; Case Code (Metric): 1005; Voltage: 50V; Height: 0.5mm
C15 C29 C30 C42 = CMP-2008-04549-2: Chip Multilayer Ceramic Capacitors for General Purpose, 0402, 4.7uF, X5R, 15%, 20%, 6.3V; Height: 0.5mm; Weight: 0.000212oz; Length: 1mm; Case Code (Metric): 1005; Packaging: Tape and Reel; Termination: SMD/SMT; Dielectric: X5R; Depth: 0.5mm; Case Code (Imperial): 0402; Min Operating Temperature: -55°C; Case/Package: 0402; Voltage: 6.3V; Width: 0.02inch; Capacitance: 4.7uF; Lead Free: Lead Free; Thickness: 0.022inch; Contact Plating: Tin; REACH SVHC: No SVHC; Package Quantity: 10000; Tolerance: 20%; Voltage Rating (DC): 6.3V; Voltage Rating: 6.3V; Mount: Surface Mount; Max Operating Temperature: 85°C
C16 = CMP-2006-02792-2: Chip Multilayer Ceramic Capacitors for General Purpose, 0603, 10uF, X5R, 15%, 20%, 6.3V; Packaging: Tape and Reel; Voltage Rating (DC): 6.3V; Width: 0.031inch; Termination: SMD/SMT; Dielectric: X5R; Package Quantity: 4000; Voltage Rating: 6.3V; Capacitance: 10uF; Case/Package: 0603; Min Operating Temperature: -55°C; Voltage: 6.3V; Length: 1.6mm; Thickness: 0.035inch; Lead Free: Lead Free; Depth: 0.8mm; Case Code (Imperial): 0603; Max Operating Temperature: 85°C; Material: Ceramic; Height: 0.8mm; Tolerance: 20%; Mount: Surface Mount; REACH SVHC: No SVHC; Radiation Hardening: No; Case Code (Metric): 1608
C17 C19-C28 C32-C41 C44 C46 = CMP-06035-000062-2: Chip Multilayer Ceramic Capacitors for General Purpose, 0201, 0.10uF, X5R, 15%, 10%, 6.3V; Min Operating Temperature: -55°C; Lead Free: Lead Free; Radiation Hardening: No; Dielectric: X5R; Voltage Rating (DC): 6.3V; REACH SVHC: No SVHC; Case/Package: 0201; Voltage Rating: 6.3V; Length: 0.6mm; Max Operating Temperature: 85°C; Width: 0.012inch; Depth: 0.3mm; Material: Ceramic; Case Code (Metric): 0603; Thickness: 0.013inch; Packaging: Tape and Reel; Height: 0.3mm; Capacitance: 100nF; Weight: 6E-06oz; Package Quantity: 1; Mount: Surface Mount; Voltage: 6.3V; Case Code (Imperial): 0201; Tolerance: 10%; Termination: SMD/SMT
C18 C31 = CMP-06035-004830-1: Chip Multilayer Ceramic Capacitors for General Purpose, 0402, 330pF, C0G, 30ppm/°C, 5%, 50V; Insulation Resistance: 10GR; REACH SVHC: No SVHC; Depth: 0.5mm; Voltage Rating (DC): 50V; Number of Pins: 2; Max Operating Temperature: 125°C; Dielectric: C0G; Tolerance: 5%; Package Quantity: 1; Length: 1mm; Thickness: 0.022inch; Case/Package: 0402; Lead Free: Lead Free; Case Code (Imperial): 0402; Material: Ceramic; Voltage Rating: 50V; Voltage: 50V; Radiation Hardening: No; Min Operating Temperature: -55°C; Packaging: Tape and Reel; Capacitance: 330pF; Case Code (Metric): 1005; Width: 0.5mm; Mount: Surface Mount; Height: 0.5mm; Temperature Coefficient: 30ppm/°C; Termination: SMD/SMT
C43 C45 = CMP-2008-04556-2: CAP CER 1UF 10V X5R 0402; Manufacturer Part Number: GRM155R61A105KE15D; Manufacturer: Murata; Material: Ceramic; Tolerance: 10%; Temperature Coefficient: 15%; Octopart: https://octopart.com/grm155r61a105ke15d-murata-197442; Lead Free: Yes; ComponentLink2Description: Datasheet; Temperature: -55°C to +85°C; Temperature Range High: +85°C; Height: 0.55mm; Capacitance: 1uF; Ipc Land Pattern Name: CAPC10050X50; ComponentLink2URL: https://search.murata.co.jp/Ceramy/image/img/A01X/G101/ENG/GRM155R61A105KE15-01A.pdf; Temperature Range Low: -55°C; Device Class L2: Capacitors; Voltage Rating: 10V; RoHS: TRUE; Device Class L1: Passive Components; Device Class L3: Ceramic Capacitors; Temperature Characteristic: X5R; Mouser Description: 0402 1 uF 10 V ±10% Tolerance X5R Surface Mount Multilayer Ceramic Capacitor; Automotive: No; Package: GRM15-0.1; Digikey Description: CAP CER 1UF 10V X5R 0402; Value: 1uF; Category: Cap
D9 D10 = CMP-22017-000005-2: LED GREEN CLEAR CHIP SMD; Dominant Wavelength: 569nm; Reverse Voltage: 5V; Lens Color: Colorless; Viewing Angle: 130°; Voltage: 2V; Forward Current: 30mA; Power Dissipation: 100mW; Luminous Intensity: 6mcd; Number of LEDs: 1; Forward Voltage: 2.1V; Wavelength: 565nm; Test Current: 10mA; Min Operating Temperature: -55°C; Lens Style: Clear; Mount: Surface Mount; Width: 0.8mm; Packaging: Tape and Reel; Lens Transparency: Clear; Case Code (Metric): 1608; Depth: 0.8mm; Case Code (Imperial): 0603; Case/Package: 0603; Number of Pins: 2; Max Operating Temperature: 85°C; Lead Free: Lead Free; Number of Elements: 1; Length: 1.6mm; Height: 0.8mm; Package Quantity: 1; Power Rating: 100mW; Radiation Hardening: No; Illumination Color: Green; Color: Green
D11 = CMP-2000-06153-1: Bridge Rectifier, 1.5 A, 1000 V, 4-Pin SDIP, RoHS, Tape and Reel; Manufacturer: FairchildSemiconductor; Configuration: Single; Peak Average Forward Current: 1.5@Ta=40CA; Peak Reverse Repetitive Voltage: 1000V; Peak Reverse Current: 5uA; Bridge Type: SinglePhase; Peak Forward Voltage: 1.1@1AV; Datasheet Version: Rev. 1.5, 05/2015; Package: 4SDIPSMD; Operating Temperature: -55to150°C; Package Reference: SDIP 4L; Datasheet URL: http://www.farnell.com/datasheets/1941063.pdf; Packaging: Tape&Reel; Manufacturer URL: https://www.fairchildsemi.com/; Mounting Technology: SurfaceMount; Category: BridgeRectifier; Package Description: 4-Pin Surface Mount Device, Body 8.28 x 6.35 mm, Pitch 5.1 mm; Mounting: SurfaceMount
FB1 = FCM1608KF-601T03: Ferrite Bead; Manufacturer_Name: TAI-TECH; Datasheet Link: https://www.tai-tech.com.tw/_upload/files/FCM1608-Series.pdf; Height: 0.95mm; Manufacturer_Part_Number: FCM1608KF-601T03
FL1 = 7448013501: Filter; Manufacturer_Name: Wurth Elektronik; Datasheet Link: https://componentsearchengine.com/Datasheets/1/7448013501.pdf; Height: 16mm; Manufacturer_Part_Number: 7448013501; Mouser Part Number: 710-7448013501; Mouser Price/Stock: https://www.mouser.com/Search/Refine.aspx?Keyword=710-7448013501
IC3 = ST1L05APU33R: Integrated Circuit; Manufacturer_Name: STMicroelectronics; Datasheet Link: https://www.st.com/resource/en/datasheet/st1l05.pdf; Height: 1mm; Manufacturer_Part_Number: ST1L05APU33R; Mouser Part Number: 511-ST1L05APU33R; Mouser Price/Stock: https://www.mouser.co.uk/ProductDetail/STMicroelectronics/ST1L05APU33R?qs=TEE7KwcILpzoVyxOB2gDPw%3D%3D; Arrow Part Number: ST1L05APU33R; Arrow Price/Stock: https://www.arrow.com/en/products/st1l05apu33r/stmicroelectronics
J7 = CMP-1684-00017-1: as J5 on sheet Misc; Datasheet URL: http://www.te.com.cn/commerce/DocumentDelivery/DDEController?Action=showdoc&DocId=Catalog+Section%7F1308389_EUROSTYLE_TERMINAL_BLOCKS%7F0607%7Fpdf%7FEnglish%7FENG_CS_1308389_EUROSTYLE_TERMINAL_BLOCKS_0607.pdf%7F282836-2; Color: Green; Family: TerminalBlocks-WiretoBoard; RoHS Information: 282836-2StatementofCompliance; Standard Package: 300; Contact Material - Plating: Brass-TinPlated; Manufacturer URL: http://www.te.com; Housing Material: Polyamide(PA66),Nylon6/6; Features: Interlocking(Side); Package Description: Female Header, Pitch 5 mm, 1 x 2 Position, Height 10 mm, Tail Length 3.5 mm; Mounting Type: ThroughHole; Package Reference: THD; Packaging: Bulk; Series: Buchanan; Category: Connectors,Interconnects; Screw Material - Plating: Brass-NickelPlated
PS1 = THL_15-2411WI: Power Supply; Manufacturer_Name: Traco Power; Manufacturer_Part_Number: THL 15-2411WI; Datasheet Link: https://componentsearchengine.com/Datasheets/1/THL 15-2411WI.pdf; Height: 10.66mm; Mouser Part Number: 495-THL15-2411WI; Mouser Price/Stock: https://www.mouser.co.uk/ProductDetail/TRACO-Power/THL-15-2411WI/?qs=vLWxofP3U2zTxW0y6%2FAPOg%3D%3D
R5 R7 = CMP-2000-00873-1: as R1 on sheet Relays
R6 R9 R10 = CMP-2002-08276-2: RES Thick Film, 1kΩ, 1%, 0.063W, 100ppm/°C, 0402; Resistance: 1kR; Power Rating: 63mW; Voltage Rating (DC): 50V; Package Quantity: 10; Termination: SMD/SMT; Width: 0.5mm; Military Standard: Not; Length: 1mm; Contact Plating: Tin; Mount: Surface Mount; Packaging: Tape and Reel; Case Code (Imperial): 0402; Tolerance: 1%; Weight: 2.3E-05oz; Number of Pins: 2; Case/Package: 0402; Case Code (Metric): 1005; Lead Free: Lead Free; Number of Terminations: 2; Max Power Dissipation: 63mW; Depth: 0.5mm; Temperature Coefficient: 100ppm/°C; Max Operating Temperature: 155°C; Height: 0.35mm; Features: Automotive AEC-Q200; Composition: Thick Film; Radiation Hardening: No; Voltage Rating: 50V; Min Operating Temperature: -55°C
R8 R11-R16 = CMP-2002-08122-2: RES Thick Film, 0Ω, 0.063W, 0402; Tolerance: 5%; Max Power Dissipation: 63mW; Voltage Rating: 50V; Temperature Coefficient: 100ppm/°C; Resistance: 0mR; Contact Plating: Tin; Height: 0.35mm; Radiation Hardening: No; Features: Automotive AEC-Q200; Composition: Thick Film; Width: 0.5mm; Weight: 2.3E-05oz; Termination: SMD/SMT; Packaging: Tape and Reel; Mount: Surface Mount; Case Code (Metric): 1005; Military Standard: Not; Min Operating Temperature: -55°C; Number of Terminations: 2; Package Quantity: 1; Case Code (Imperial): 0402; Depth: 0.5mm; Max Operating Temperature: 155°C; Case/Package: 0402; Power Rating: 63mW; Lead Free: Lead Free; Voltage Rating (DC): 50V; Length: 1mm
S1 = 1825232-1: Switch; Manufacturer_Name: TE Connectivity; Datasheet Link: https://componentsearchengine.com/Datasheets/1/1825232-1.pdf; Height: 3.7mm; Manufacturer_Part_Number: 1825232-1; Mouser Part Number: 655-1825232-1; Mouser Price/Stock: https://www.mouser.co.uk/ProductDetail/TE-Connectivity-PB/1825232-1?qs=kTKVN3NWb5FosGxaNC1%252BtA%3D%3D; Arrow Part Number: 1825232-1; Arrow Price/Stock: https://www.arrow.com/en/products/1825232-1/te-connectivity
U1 = CMP-12105-000055-1: HIGH-PERFORMANCE AND DSP WITH DP; Manufacturer: STMicroelectronics; Number Of Uart Channels: 9; Number Of Pwm Channels: 2; Memory Size: 2MBytes; Number Of Ethernet Channels: 1; Ram Size: 1MBytes; Number Of Timers/Counters: 22; Data Bus Width: 32bits; Core Architecture: ARM Cortex-M4, ARM Cortex-M7; Interface: I2C,SPI,UART,USART,CAN,USB,LIN,IrDA,Ethernet,I2S,SMBus,Other; Number Of Adc Channels: 36; Min Supply Voltage: 1.2V; Number Of A/D Converters: 3; Number Of Spi Channels: 6; Max Supply Voltage: 3.6V; Frequency: 480MHz; Memory Type: FLASH; Number Of I2C Channels: 4; Max Junction Temp: +125°C; Standoff Height: 0.15mm; Number Of I/Os: 168; Device Class L2: Embedded Processors and Controllers; Digikey Description: HIGH-PERFORMANCE AND DSP WITH DP; RoHS: TRUE; Lead Free: Yes; Manufacturer Part Number: STM32H747XIH6; ComponentLink2URL: https://www.st.com/resource/en/datasheet/stm32h747xi.pdf; Mouser Description: STM32 Series 2 MB Flash 1 MB RAM 480 MHz 32-Bit Microcontroller - TFBGA-265; Device Class L1: Integrated Circuits (ICs); Ipc Land Pattern Name: BGA289N80P17X17_1400X1400X110; Category: IC; Device Class L3: Microcontrollers; Ambient Temperature Range High: +85°C; Number Of Cores: 2; Temperature Range High: +125°C; ComponentLink2Description: Datasheet; Automotive: No; Ambient Temperature Range Low: -40°C; Package: TFBGA240+25-A07U; Temperature: -40°C to +125°C; Number Of Usb Channels: 2; Temperature Range Low: -40°C; Height: 1.1mm; Octopart: https://octopart.com/stm32h747xih6-stmicroelectronics-100293943
Y1 = NZ2520SB-133M-END4825A: Crystal or Oscillator; Manufacturer_Name: NDK; Datasheet Link: https://media.digikey.com/pdf/Data%20Sheets/NDK%20PDFs/NZ2520SB-133M-END4825A.pdf; Manufacturer_Part_Number: NZ2520SB-133M-END4825A; Mouser Part Number: 344-NZ2520SB1334825A; Mouser Price/Stock: https://www.mouser.co.uk/ProductDetail/NDK/NZ2520SB-133M-END4825A?qs=w%2Fv1CP2dgqoOMP%2FVt8jH%252BA%3D%3D
Y2 = CMP-2000-07587-1: Tuning Fork Crystal, 32.768 KHz, +/- 20 ppm, -40 to 85 degC, 2-Pin SMD, RoHS, Tape and Reel; Manufacturer: Abracon; Case\/Package: SMD/SMT; Series Resistance: 60KOhm; Frequency Tolerance: 20ppm; Load Capacitance: 6pF; ESR (Equivalent Series Resistance): 55KOhm; Max Operating Temperature: 85degC; Width: 0.061inch; Radiation Hardening: No; Lead Free: LeadFree; RoHSCompliant: True; Depth: 1.5mm; Datasheet URL: http://www.abracon.com/Resonators/ABS07-120-32.768kHz-T.pdf; Frequency: 32.768KHz; Termination: SMD/SMT; Manufacturer URL: http://www.abracon.com/; Package Quantity: 3000; Packaging: TapeandReel; Number of Pins: 2; Height: 0.035inch; Package Description: 2-Pin Surface Mount Device, Body 3.2 x 1.5 mm; Package Reference: ABS07; Mount: SurfaceMount; Tolerance: 20ppm; Mounting Technology: SurfaceMount; REACH SVHC: NoSVHC; Datasheet Version: 11/2014; Length: 3.2mm; Min Operating Temperature: -40degC

## Nets that join several sheets
GND: Wi-Fi (28 pins), LCD (5 pins), JTAG (19 pins), Relays (Q1.2 Q2.2 Q3.2 Q4.2), Misc (P1.3 SW1.2 SW1.3 SW1.4), CPU (89 pins)
NetC11_2: Wi-Fi (IC2.23), LCD (J2.14 J2.15), JTAG (7 pins), Misc (P1.4), CPU (55 pins)
NetIC2_39: Wi-Fi (IC2.39), CPU (U1.C12)
NetIC2_40: Wi-Fi (IC2.40), CPU (U1.D12)
NetIC2_41: Wi-Fi (IC2.41), CPU (U1.E13)
NetIC2_42: Wi-Fi (IC2.42), CPU (U1.E14)
NetIC2_43: Wi-Fi (IC2.43), CPU (U1.A13)
NetIC2_44: Wi-Fi (IC2.44), CPU (U1.B13)
NetIC2_50: Wi-Fi (IC2.50), CPU (U1.A9)
NetIC2_69: Wi-Fi (IC2.69), JTAG (J3.1)
NetIC2_70: Wi-Fi (IC2.70), JTAG (J3.3)
NetIC2_71: Wi-Fi (IC2.71), JTAG (J3.5)
NetIC2_72: Wi-Fi (IC2.72), JTAG (J3.7)
NetIC2_73: Wi-Fi (IC2.73), JTAG (J3.9)
NetIC2_74: Wi-Fi (IC2.74), JTAG (J3.11)
NetIC2_75: Wi-Fi (IC2.75), JTAG (J3.13)
NetJ2_2: LCD (J2.2), CPU (U1.K17)
NetJ2_3: LCD (J2.3), CPU (U1.K16)
NetJ2_5: LCD (J2.5), CPU (U1.L17)
NetJ2_6: LCD (J2.6), CPU (U1.L16)
NetJ2_8: LCD (J2.8), CPU (U1.M17)
NetJ2_9: LCD (J2.9), CPU (U1.M16)
NetJ2_11: LCD (J2.11), Misc (P1.2), CPU (R7.2 U1.R16)
NetJ2_12: LCD (J2.12), Misc (P1.1), CPU (R5.2 U1.R17)
NetJ4_5: JTAG (J4.5 RN2.4), CPU (U1.A14)
NetJ4_7: JTAG (J4.7 RN2.3), CPU (U1.C15)
NetJ4_9: JTAG (J4.9 RN2.2), CPU (U1.B14)
NetJ4_13: JTAG (J4.13 RN2.1), CPU (U1.C6)
NetJ4_15: JTAG (J4.15), CPU (U1.B7)
NetJ5_1: Relays (K4.14 K4.15), Misc (J5.1)
NetJ5_2: Relays (K2.14 K2.15), Misc (J5.2)
NetJ6_1: Relays (K1.14 K1.15), Misc (J6.1)
NetJ6_2: Relays (K3.14 K3.15), Misc (J6.2)
NetR1_1: Relays (R1.1), CPU (U1.A3)
NetR2_1: Relays (R2.1), CPU (U1.A4)
NetR3_1: Relays (R3.1), CPU (U1.A2)
NetR4_1: Relays (R4.1), CPU (U1.A5)
NetSW1_1: Misc (SW1.1), CPU (U1.A10)